# Altium schematic sheet faketec-yuri_v1.1.SchDoc
size A3
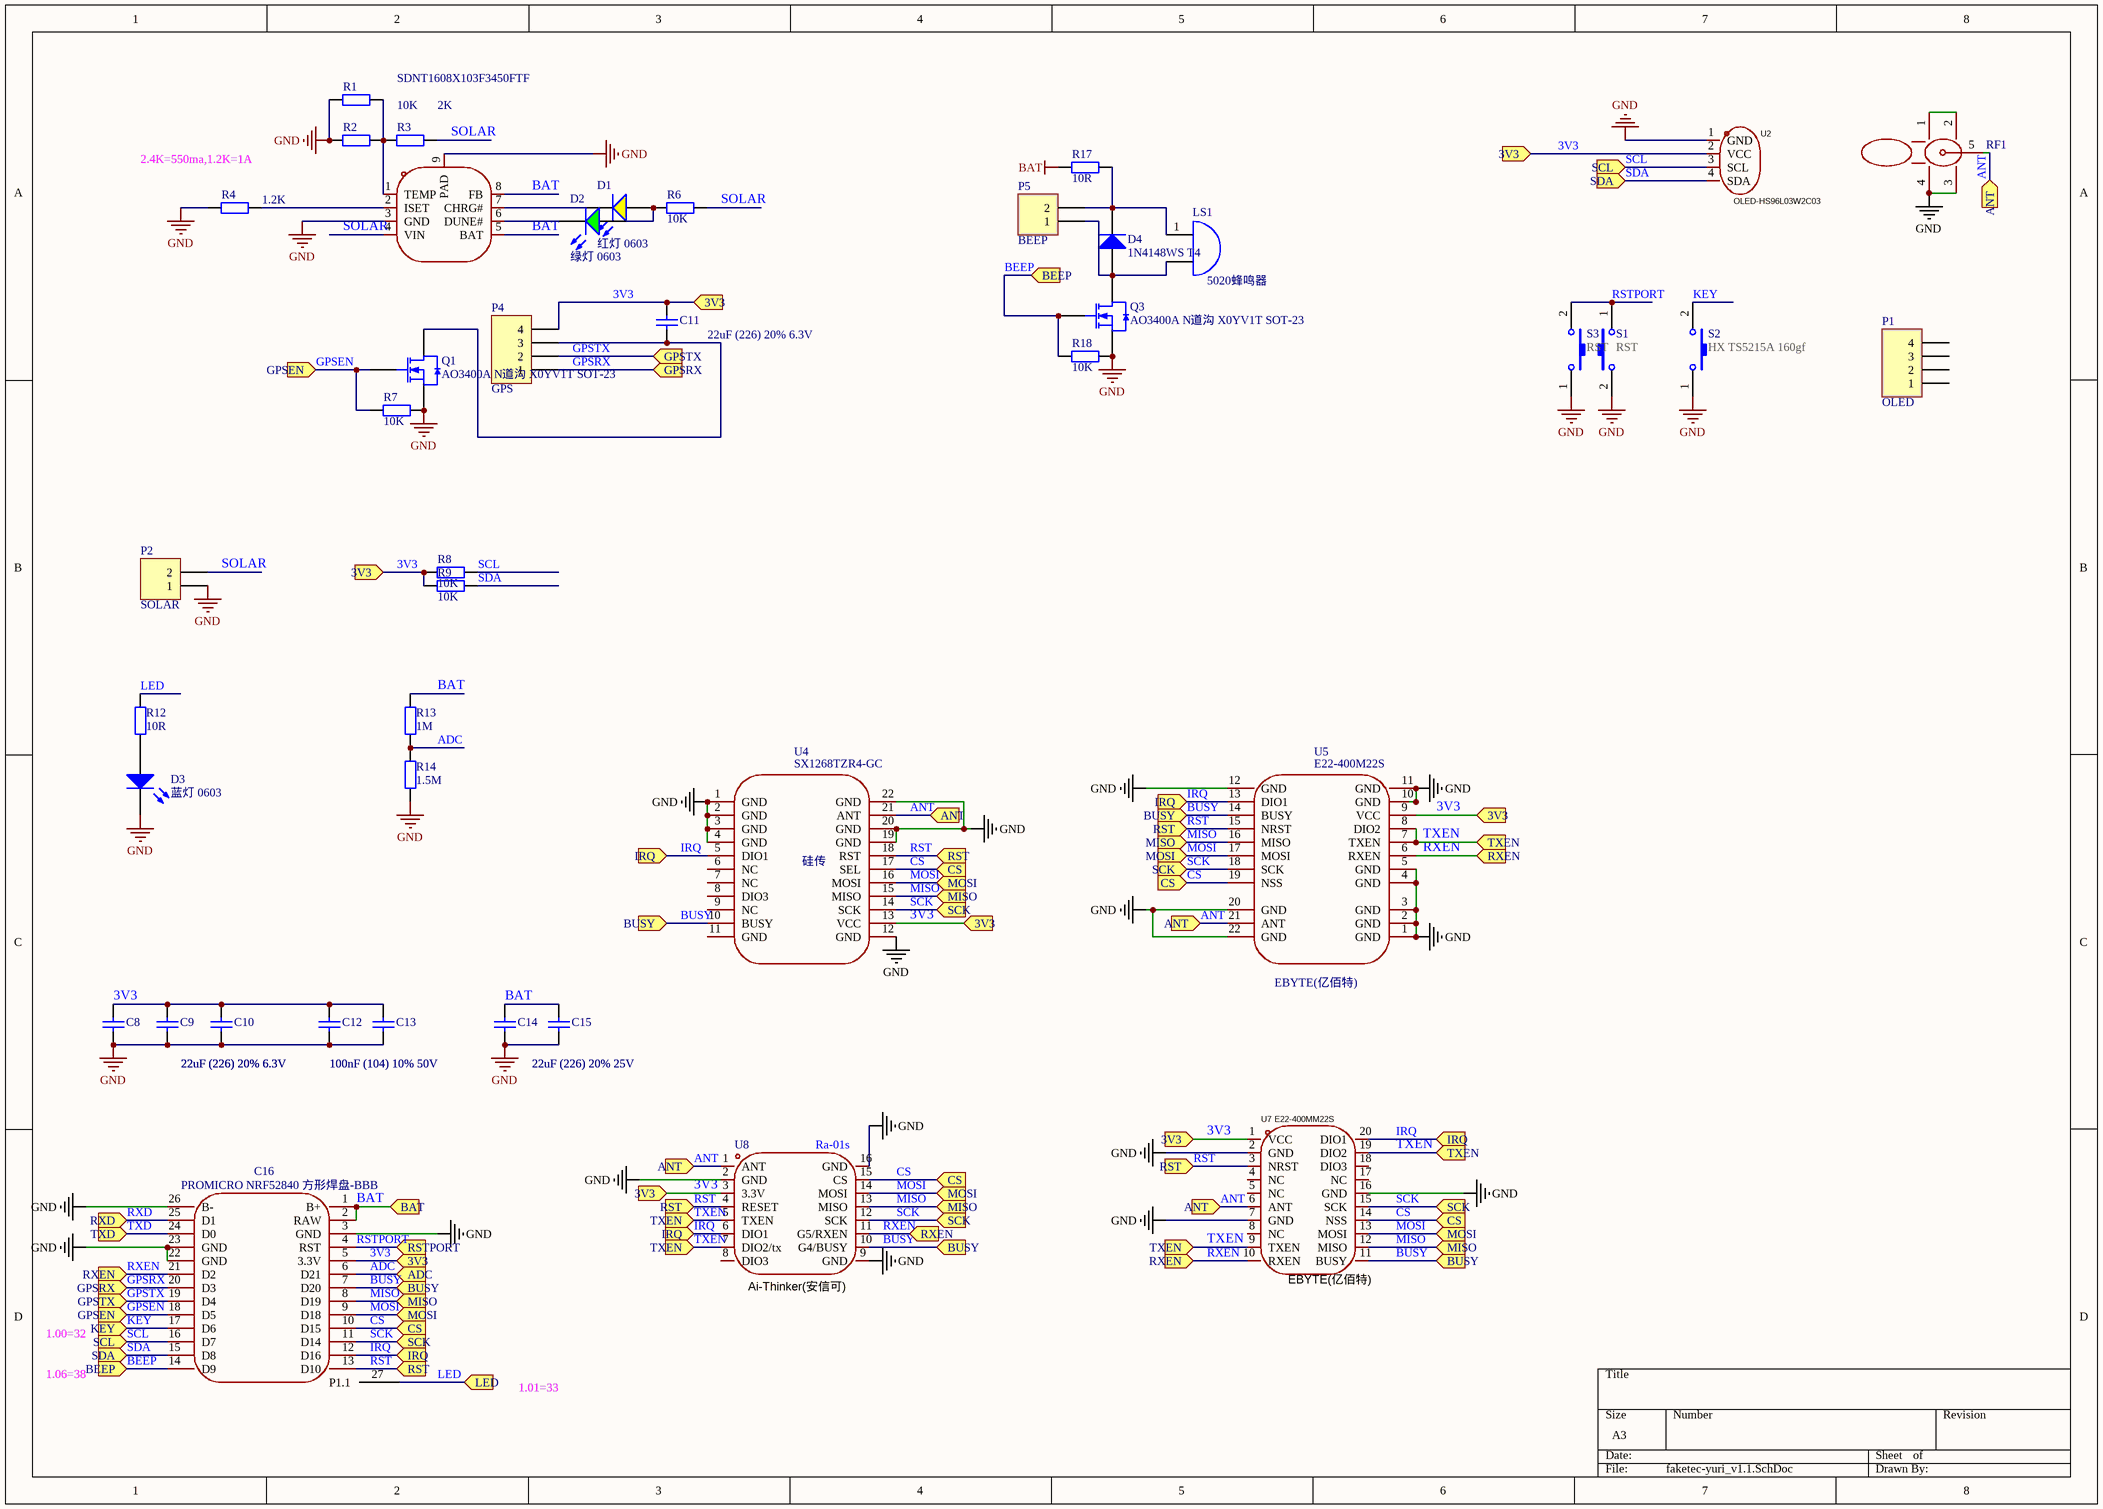
[diagram p0: faketec-yuri_v1.1.SchDoc]

## Parts
C8  22uF (226) 20% 6.3V  [0603_C]
C9  22uF (226) 20% 6.3V  [0603_C]
C10  22uF (226) 20% 6.3V  [0603_C]
C11  22uF (226) 20% 6.3V  [0603_C]
C12  100nF (104) 10% 50V  [0603_C]
C13  100nF (104) 10% 50V  [0603_C]
C14  22uF (226) 20% 25V  [0805_C]
C15  22uF (226) 20% 25V  [0805_C]
C16  PROMICRO NRF52840 方形焊盘-BBB  [PROMICRO NRF52840]
D1  红灯 0603  [0603_LED_S1]
D2  绿灯 0603  [0603_LED_S1]
D3  蓝灯 0603  [0603_LED_S1]
D4  1N4148WS T4  [SOD-323]
LS1  5020蜂鸣器  [PB5020]
P1  OLED  [HT1.25-4]
P2  SOLAR  [HDR1X2]
P4  GPS  [HT1.25-4]
P5  BEEP  [HDR1X2]
Q1  AO3400A N道沟 X0YV1T SOT-23  [SOT-23-3L]
Q3  AO3400A N道沟 X0YV1T SOT-23  [SOT-23-3L]
R1  SDNT1608X103F3450FTF  [0603_R]
R2  10K  [0603_R]
R3  2K  [0603_R]
R4  1.2K  [0603_R]
R6  10K  [0603_R]
R7  10K  [0603_R]
R8  10K  [0603_R]
R9  10K  [0603_R]
R12  10R  [0603_R]
R13  1M  [0603_R]
R14  1.5M  [0603_R]
R17  10R  [0603_R]
R18  10K  [0603_R]
RF1  SMA-KWE901  [SMA-TH_BWSMA-KWE-Z001]  (value not drawn)
S1  RST  [BTIANLE-2x4x35]
S2  HX TS5215A 160gf  [BTIANLE-35x7x35]
S3  RST  [BTIANLE-2x4x35]
U2  OLED-HS96L03W2C03  [OLED-TH_L27.8-W27.2-P2.54_C9900033791]
U3  CN3163  [SOP-8_EP_150mil]  (value not drawn)
U4  SX1268TZR4-GC  Manufacturer: 硅传  [SX1268TZR4-GC]
U5  E22-400M22S  Manufacturer: EBYTE(亿佰特)  [E22-400M22S]
U7  E22-400MM22S  Manufacturer: EBYTE(亿佰特)  [E22-400MM22S]
U8  Ra-01s  Manufacturer: Ai-Thinker(安信可)  [RA-01]

## Ports
3V3 (in), ADC (in), ANT (in), BAT (in), BEEP (in), BUSY (in), CS (in), GPSEN (in), GPSRX (in), GPSTX (in), IRQ (in), KEY (in), LED (in), MISO (in), MOSI (in), RST (in), RSTPORT (in), RXD (in), RXEN (in), SCK (in), SCL (in), SDA (in), TXD (in), TXEN (in)

## Nets
BAT: C14.2 C15.2 C16.1(B+) C16.2(RAW) R13.2 R17.2 U3.5(BAT) U3.8(FB) ; port BAT
GND: C8.1 C9.1 C10.1 C12.1 C13.1 C14.1 C15.1 C16.3(GND) C16.22(GND) C16.23(GND) C16.26(B-) D3.K P2.1 Q1.2(S) Q3.2(S) R1.1 R2.1 R4.1 R7.1 R14.1 R18.1 RF1.3 RF1.4 S1.2 S2.1 S3.1 U2.1(GND) U3.3(GND) U3.9(PAD) U4.1(GND) U4.2(GND) U4.3(GND) U4.4(GND) U4.12(GND) U4.19(GND) U4.20(GND) U4.22(GND) U5.1(GND) U5.2(GND) U5.3(GND) U5.4(GND) U5.5(GND) U5.10(GND) U5.11(GND) U5.12(GND) U5.20(GND) U5.22(GND) U7.2(GND) U7.7(GND) U7.16(GND) U8.2(GND) U8.9(GND) U8.16(GND)
3V3: C8.2 C9.2 C10.2 C11.2 C12.2 C13.2 C16.5(3.3V) P4.4 R8.2 R9.2 U2.2(VCC) U4.13(VCC) U5.9(VCC) U7.1(VCC) U8.3(3.3V) ; port 3V3
ADC: C16.6(D21) R13.1 R14.2 ; port ADC
ANT: RF1.5 U4.21(ANT) U5.21(ANT) U7.6(ANT) U8.1(ANT) ; port ANT
BEEP: C16.14(D9) Q3.1(G) R18.2 ; port BEEP
BUSY: C16.7(D20) U4.10(BUSY) U5.14(BUSY) U7.11(BUSY) U8.10(G4/BUSY) ; port BUSY
CS: C16.10(D15) U4.17(SEL) U5.19(NSS) U7.14(NSS) U8.15(CS) ; port CS
GPSEN: C16.18(D5) Q1.1(G) R7.2 ; port GPSEN
GPSRX: C16.20(D3) P4.1 ; port GPSRX
GPSTX: C16.19(D4) P4.2 ; port GPSTX
IRQ: C16.12(D16) U4.5(DIO1) U5.13(DIO1) U7.20(DIO1) U8.6(DIO1) ; port IRQ
KEY: C16.17(D6) S2.2 ; port KEY
LED: C16.27(P1.1) R12.1 ; port LED
MISO: C16.8(D19) U4.15(MISO) U5.16(MISO) U7.12(MISO) U8.13(MISO) ; port MISO
MOSI: C16.9(D18) U4.16(MOSI) U5.17(MOSI) U7.13(MOSI) U8.14(MOSI) ; port MOSI
RST: C16.13(D10) U4.18(RST) U5.15(NRST) U7.3(NRST) U8.4(RESET) ; port RST
RSTPORT: C16.4(RST) S1.1 S3.2 ; port RSTPORT
RXD: C16.25(D1) ; port RXD
RXEN: C16.21(D2) U5.6(RXEN) U7.10(RXEN) U8.11(G5/RXEN) ; port RXEN
SCK: C16.11(D14) U4.14(SCK) U5.18(SCK) U7.15(SCK) U8.12(SCK) ; port SCK
SCL: C16.16(D7) R8.1 U2.3(SCL) ; port SCL
SDA: C16.15(D8) R9.1 U2.4(SDA) ; port SDA
SOLAR: P2.2 R3.2 R6.1 U3.4(VIN)
TXD: C16.24(D0) ; port TXD
TXEN: U5.7(TXEN) U5.8(DIO2) U7.9(TXEN) U7.19(DIO2) U8.5(TXEN) U8.7(DIO2/tx) ; port TXEN
NetC11_1: C11.1 P4.3 Q1.3(D)
NetD1_A: D1.A D2.A R6.2
NetD1_K: D1.K U3.7(CHRG#)
NetD2_K: D2.K U3.6(DUNE#)
NetD3_A: D3.A R12.2
NetD4_1: D4.1(A) LS1.2(B) P5.1 Q3.3(D)
NetD4_2: D4.2(K) LS1.1(A) P5.2 R17.1
NetR1_2: R1.2 R2.2 R3.1 U3.1(TEMP)
NetR4_2: R4.2 U3.2(ISET)
NetRF1_1: RF1.1 RF1.2

Not connected (* = marked no-connect by the designer): P1 1 2 3 4; U4 6(NC) 7(NC) 8(DIO3) 9(NC) 11(GND); U7 4(NC) 5(NC) 8(NC) 17(NC) 18(DIO3); U8 8(DIO3)

## Notes on the sheet
- (near R4) 2.4K=550ma,1.2K=1A
- 1.00=32
- 1.06=38
- 1.01=33

## Library data of the parts
C8-C11 = 0603 22uF (226) 20% 6.3V: 贴片电容; ComponentLink1Description: 供应商链接; ComponentLink1URL: http://www.szlcsc.com/product/details_60514.html; Package: 0603; Supplier: LC; SuppliersPartNumber: C59461
C12 C13 = 0603 100nF (104) 10% 50V: 贴片电容; ComponentLink1Description: 供应商链接; ComponentLink1URL: http://www.szlcsc.com/product/details_15331.html; Package: 0603; Supplier: LC; SuppliersPartNumber: C14663
C14 C15 = 0805 22uF (226) 20% 25V: 贴片电容; ComponentLink1Description: 供应商链接; ComponentLink1URL: http://www.szlcsc.com/product/details_46786.html; Package: 0805; Supplier: LC; SuppliersPartNumber: C45783
C16 = PROMICRO NRF52840 方形焊盘-BBB: Convert to PCB: yes; Symbol: PROMICRO NRF52840 方形焊盘-BBB; Device: PROMICRO NRF52840 方形焊盘-BBB; Supplier: JaDoma; Add into BOM: yes; Origin Footprint: PROMICRO NRF52840
D1 = 0603 黄灯: 发光二极管; ComponentLink1Description: 供应商链接; ComponentLink1URL: http://www.szlcsc.com/product/details_73147.html; Package: 0603; Supplier: LC; SuppliersPartNumber: C72038
D2 = 0603 绿灯: 发光二极管; ComponentLink1Description: 供应商链接; ComponentLink1URL: http://www.szlcsc.com/product/details_73152.html; Package: 0603; Supplier: LC; SuppliersPartNumber: C72043
D3 = 0603 蓝灯: 发光二极管; ComponentLink1Description: 供应商链接; ComponentLink1URL: http://www.szlcsc.com/product/details_73150.html; Package: 0603; Supplier: LC; SuppliersPartNumber: C72041
D4 = SOD-323 1N4148WS T4: 二极管; ComponentLink1Description: 供应商链接; ComponentLink1URL: http://www.szlcsc.com/product/details_2485.html; Package: SOD-323; Supplier: LC; SuppliersPartNumber: C2128
LS1 = Bell: 蜂鸣器; Published: 24-Mar-1999; LatestRevisionDate: 17-Jul-2002; LatestRevisionNote: Re-released for DXP Platform.; PackageReference: PIN2; WWW: https://item.szlcsc.com/97698.html
P1 P4 = Header 4: Header, 4-Pin; LatestRevisionDate: 17-Jul-2002; LatestRevisionNote: Re-released for DXP Platform.; Publisher: Altium Limited
P2 P5 = Header 2: Header, 2-Pin; LatestRevisionDate: 17-Jul-2002; LatestRevisionNote: Re-released for DXP Platform.; Publisher: Altium Limited
Q1 Q3 = AO3400A N道沟 X0YV1T SOT-23: MOS(场效应管); ComponentLink1Description: 供应商链接; ComponentLink1URL: http://www.szlcsc.com/product/details_21629.html; Package: SOT-23; Supplier: LC; SuppliersPartNumber: C20917
R1-R4 R7 R18 = 0603 2.4KΩ (2401) 1%: 贴片电阻; ComponentLink1Description: 供应商链接; ComponentLink1URL: http://www.szlcsc.com/product/details_23667.html; Package: 0603; Supplier: LC; SuppliersPartNumber: C22940
R6 R8 R9 R13 R14 = Res2: Resistor; Published: 8-Jun-2000; LatestRevisionDate: 17-Jul-2002; LatestRevisionNote: Re-released for DXP Platform.; PackageReference: AXIAL-0.4; Publisher: Altium Limited
R12 = 0603 10Ω (10R0) 1%: 贴片电阻; ComponentLink1Description: 供应商链接; ComponentLink1URL: http://www.szlcsc.com/product/details_23586.html; Package: 0603; Supplier: LC; SuppliersPartNumber: C22859
R17 = 0603 100KΩ (1003) 1%: 贴片电容; ComponentLink1Description: 供应商链接; ComponentLink1URL: http://www.szlcsc.com/product/details_26546.html; Package: 0603; Supplier: LC; SuppliersPartNumber: C25803
RF1 = SMA-KWE901: 连接器类型:板端;射频系列:RP-SMA;接口类型:内针;端口数量:1;阻抗:50Ω;频率-最大值:3GHz;样式:弯头;接口直径:5.35mm;接口长度/高度:-;工作温度范围:-55℃~+125℃;; Manufacturer: DreamLNK(骏晔科技); Add into BOM: yes; Connector Type: 板端; RF Series: RP-SMA; Interface Type: 内针; Number of Ports: 1; Impedance: 50Ω; Frequency-Max: 3GHz; Style: 弯头; Interface Diameter: 5.35mm; Symbol: SMA-KWE901; Device: SMA-KWE901; LCSC Part Name: RP-SMA 内针 弯头; Supplier Part: C914553; Manufacturer Part: SMA-KWE901; Supplier Footprint: 插件; JLCPCB Part Class: 扩展库; Datasheet: https://atta.szlcsc.com/upload/public/pdf/source/20201104/C914553_445A08C9327C0F2CC38E87EA67A0361E.pdf; Supplier: LCSC; Convert to PCB: yes; Interface Length/Height: -; Operating Temperature Range: -55℃~+125℃
S1-S3 = SW-PB: 3*6MM 轻触开关 贴片2脚 侧按 微动开关 按键开关 3*6*3.5卧式; Published: 24-Mar-1999; LatestRevisionDate: 17-Jul-2002; LatestRevisionNote: Re-released for DXP Platform.; PackageReference: SPST-2; Publisher: Altium Limited
U2 = HS96L03W2C03: Manufacturer: HS(汉昇); Add into BOM: yes; Main Control Chip: SSD1315; Interface Type: I2C; Pixel Resolution: 128x64; Symbol: HS96L03W2C03; Device: HS96L03W2C03; LCSC Part Name: 0.96寸OLED显示屏窄白光IIC; Supplier Part: C5248080; Manufacturer Part: HS96L03W2C03; Supplier Footprint: -; JLCPCB Part Class: Extended Part; Datasheet: https://atta.szlcsc.com/upload/public/pdf/source/20230627/763D01F79A90007632F098068C7C8AD9.pdf; Supplier: LCSC; Convert to PCB: yes; Size: 0.96; Operating Temperature: -40℃~+70℃
U3 = CN3163: Manufacturer: CONSONANCE(上海如韵); Add into BOM: yes; Symbol: CN3163; Device: CN3163; LCSC Part Name: CN3163; Supplier Part: C559031; Manufacturer Part: CN3163; Supplier Footprint: ESOP-8; JLCPCB Part Class: Extended Part; Datasheet: https://atta.szlcsc.com/upload/public/pdf/source/20200525/C559031_07C3DFF767A107D34DBB0F6756A9105C.pdf; Supplier: LCSC; Convert to PCB: yes
U4 U5 = E22-400M22S: Convert to PCB: yes; Origin Footprint: WIRELM-SMD_E22-400M22S; Supplier: LCSC; JLCPCB Part Class: Extended Part; Add into BOM: yes
  U4: Symbol: SX1268TZR4-GC; Device: SX1268TZR4-GC; Manufacturer Part: SX1268TZR4-GC
  U5: Symbol: E22-400M22S; Device: E22-400M22S; Supplier Part: C411291; Manufacturer Part: E22-400M22S
U7 = E220-400MM22S: Add into BOM: yes; Value: 470MHz；433MHz; Symbol: E220-400MM22S; Device: E220-400MM22S; LCSC Part Name: LoRa扩频无线模块进口LLCC68+PA+LNA低功耗433M小体积; Supplier Part: C5352932; Manufacturer Part: E220-400MM22S; Supplier Footprint: SMD,10x10mm; JLCPCB Part Class: Extended Part; Datasheet: https://atta.szlcsc.com/upload/public/pdf/source/20230113/ADF9FB7794EF3DB1C0D0199CB3018B5B.pdf; Supplier: LCSC; Convert to PCB: yes
U8 = Ra-01: SX1278LoRa扩频无线模块/超远10KM/433M/安信可Ra-01; Add into BOM: yes; Symbol: RA-01; Device: Ra-01; LCSC Part Name: SX1278LoRa扩频无线模块/超远10KM/433M  配天线（两件套）; Supplier Part: C90040; Manufacturer Part: Ra-01s; Supplier Footprint: -; JLCPCB Part Class: 扩展库; Datasheet: https://atta.szlcsc.com/upload/public/pdf/source/20180719/C90040_7D0E540C57BE745D85EF9B627FE97069.pdf; Supplier: LCSC; Convert to PCB: yes